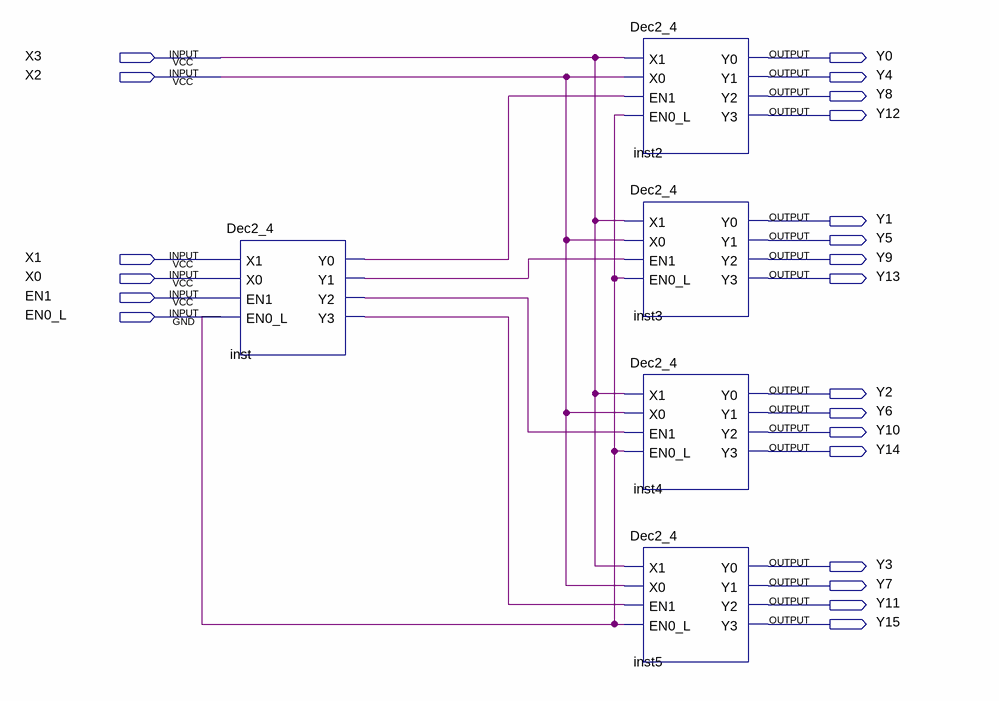
[diagram p0: schematic sheet]
// Quartus schematic Dec4_16.bdf as structural Verilog: 5 symbols, 22 pins
module Dec4_16 (
  input  X3,
  input  X2,
  input  X1,
  input  X0,
  input  EN1,
  input  EN0_L,
  output Y0,
  output Y4,
  output Y8,
  output Y12,
  output Y1,
  output Y5,
  output Y9,
  output Y13,
  output Y2,
  output Y6,
  output Y10,
  output Y14,
  output Y3,
  output Y7,
  output Y11,
  output Y15
);

  wire inst_y0, inst_y1, inst_y2, inst_y3;

  Dec2_4 inst (.X1(X1), .X0(X0), .EN1(EN1), .EN0_L(EN0_L), .Y0(inst_y0), .Y1(inst_y1), .Y2(inst_y2), .Y3(inst_y3));
  Dec2_4 inst2 (.X1(X3), .X0(X2), .EN1(inst_y0), .EN0_L(EN0_L), .Y0(Y0), .Y1(Y4), .Y2(Y8), .Y3(Y12));
  Dec2_4 inst3 (.X1(X3), .X0(X2), .EN1(inst_y1), .EN0_L(EN0_L), .Y0(Y1), .Y1(Y5), .Y2(Y9), .Y3(Y13));
  Dec2_4 inst4 (.X1(X3), .X0(X2), .EN1(inst_y2), .EN0_L(EN0_L), .Y0(Y2), .Y1(Y6), .Y2(Y10), .Y3(Y14));
  Dec2_4 inst5 (.X1(X3), .X0(X2), .EN1(inst_y3), .EN0_L(EN0_L), .Y0(Y3), .Y1(Y7), .Y2(Y11), .Y3(Y15));
endmodule
